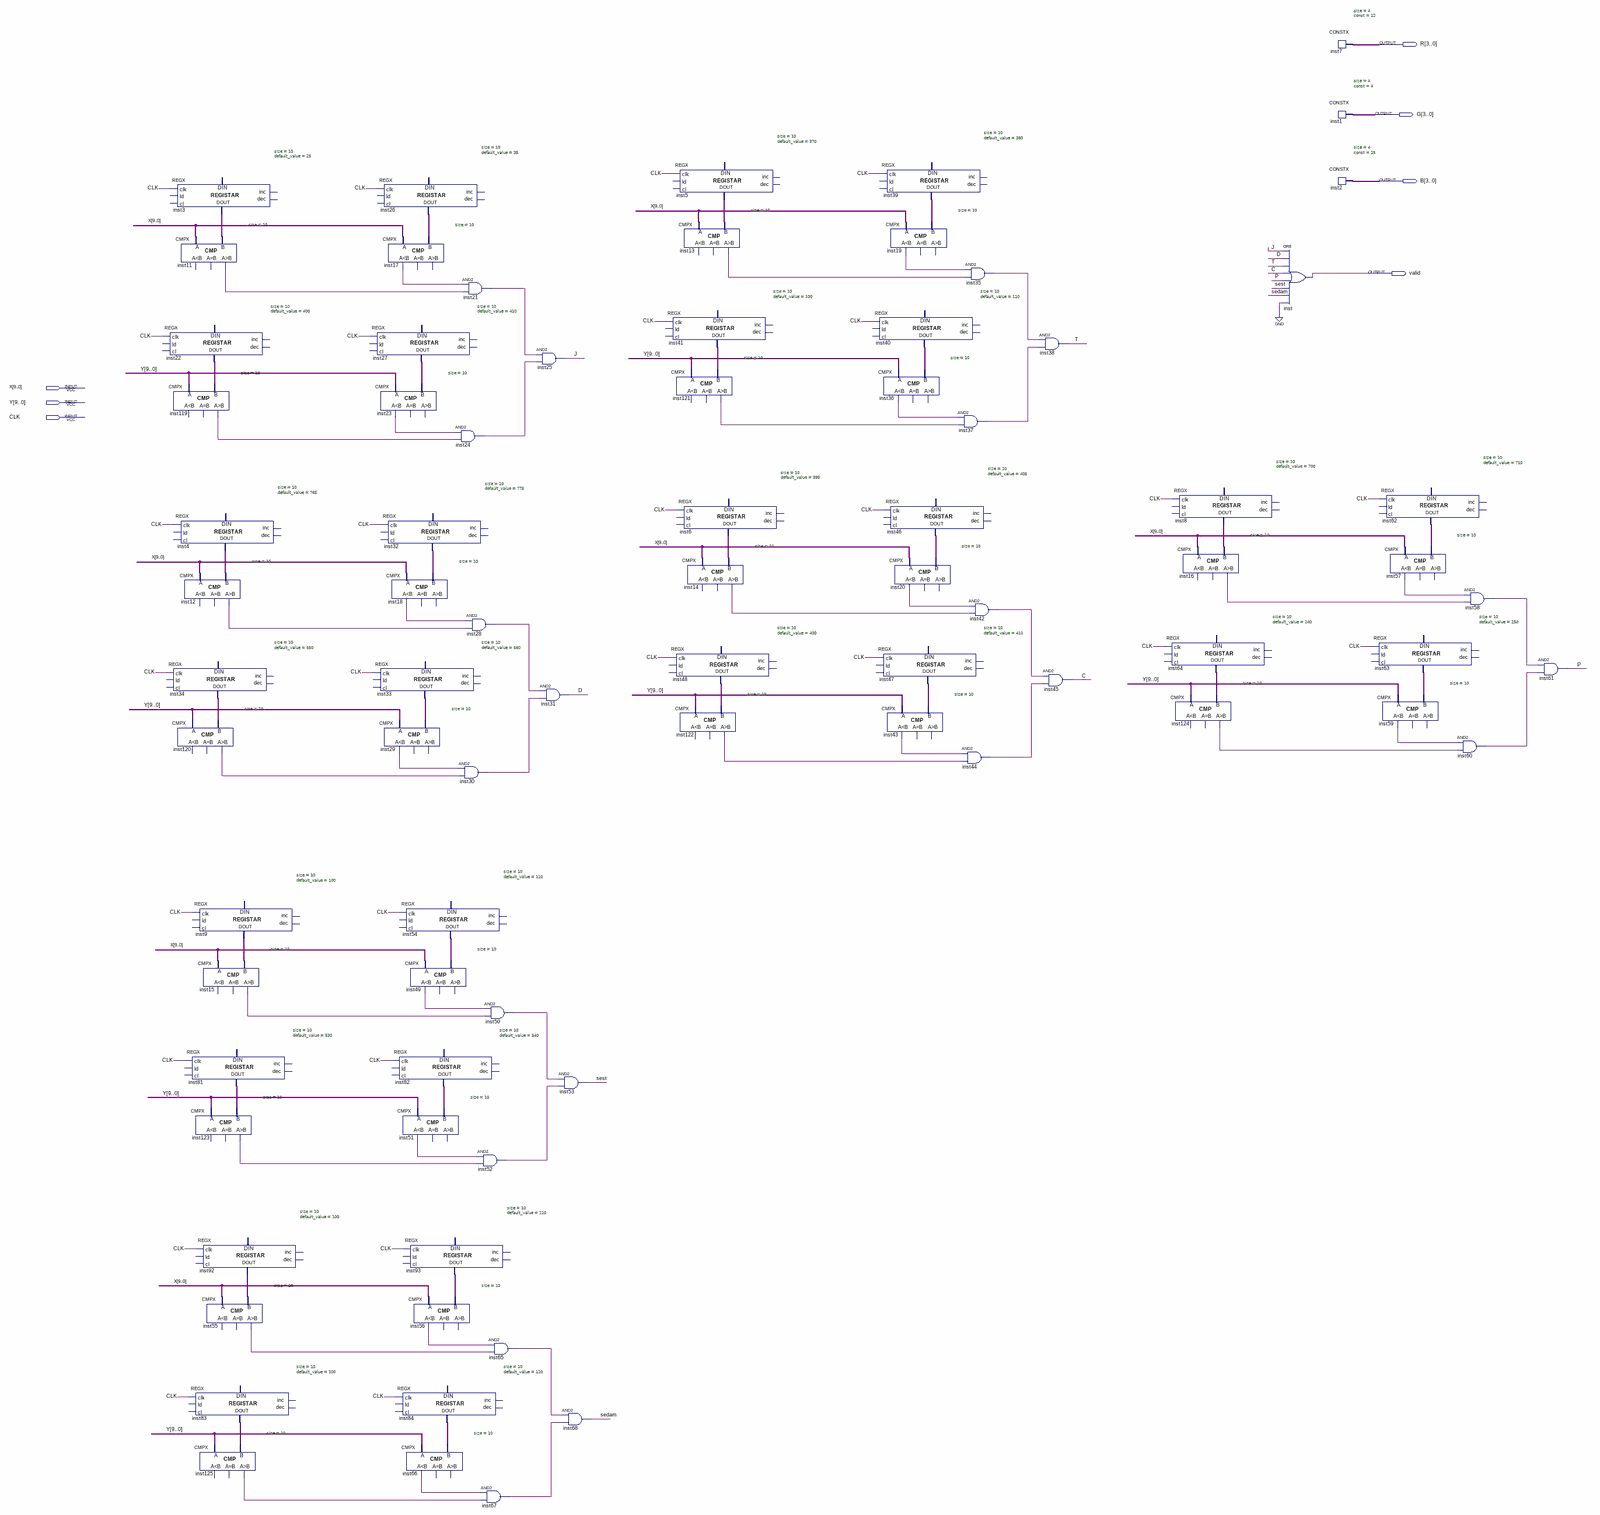
[diagram p0: schematic sheet, whole]
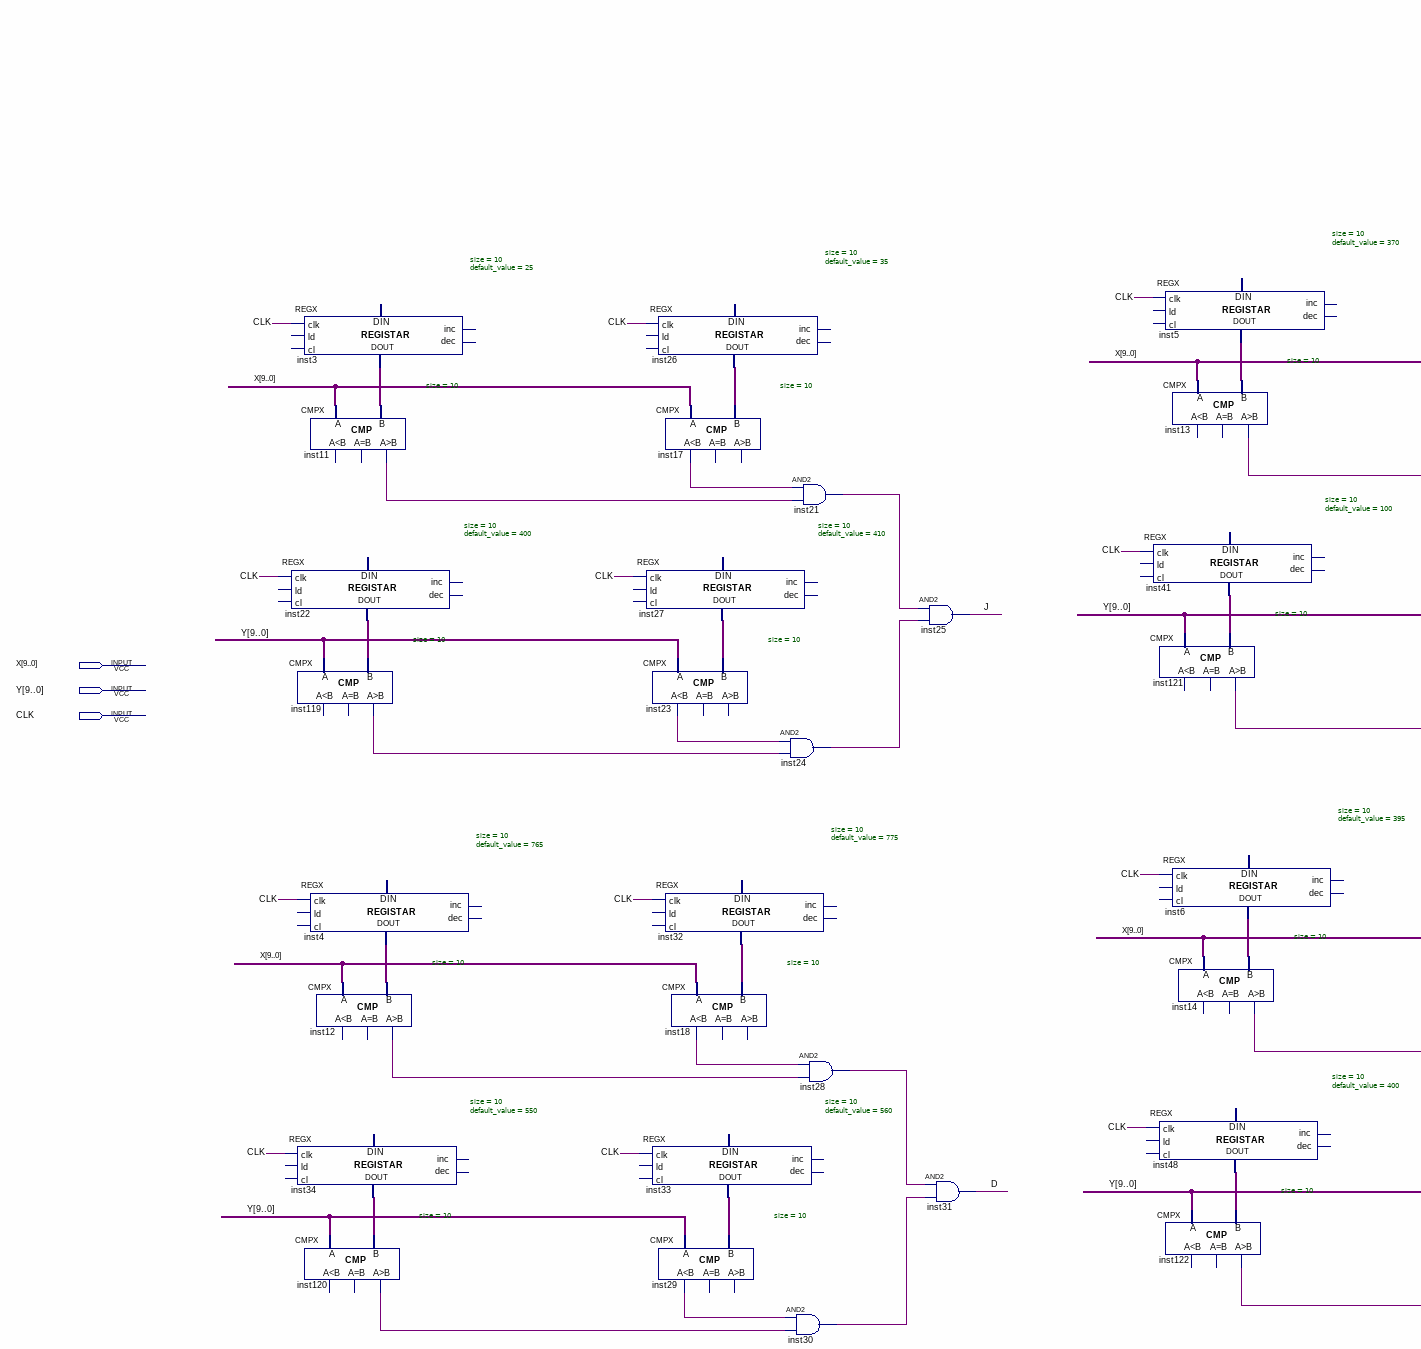
[diagram p1: schematic sheet, upper left part]
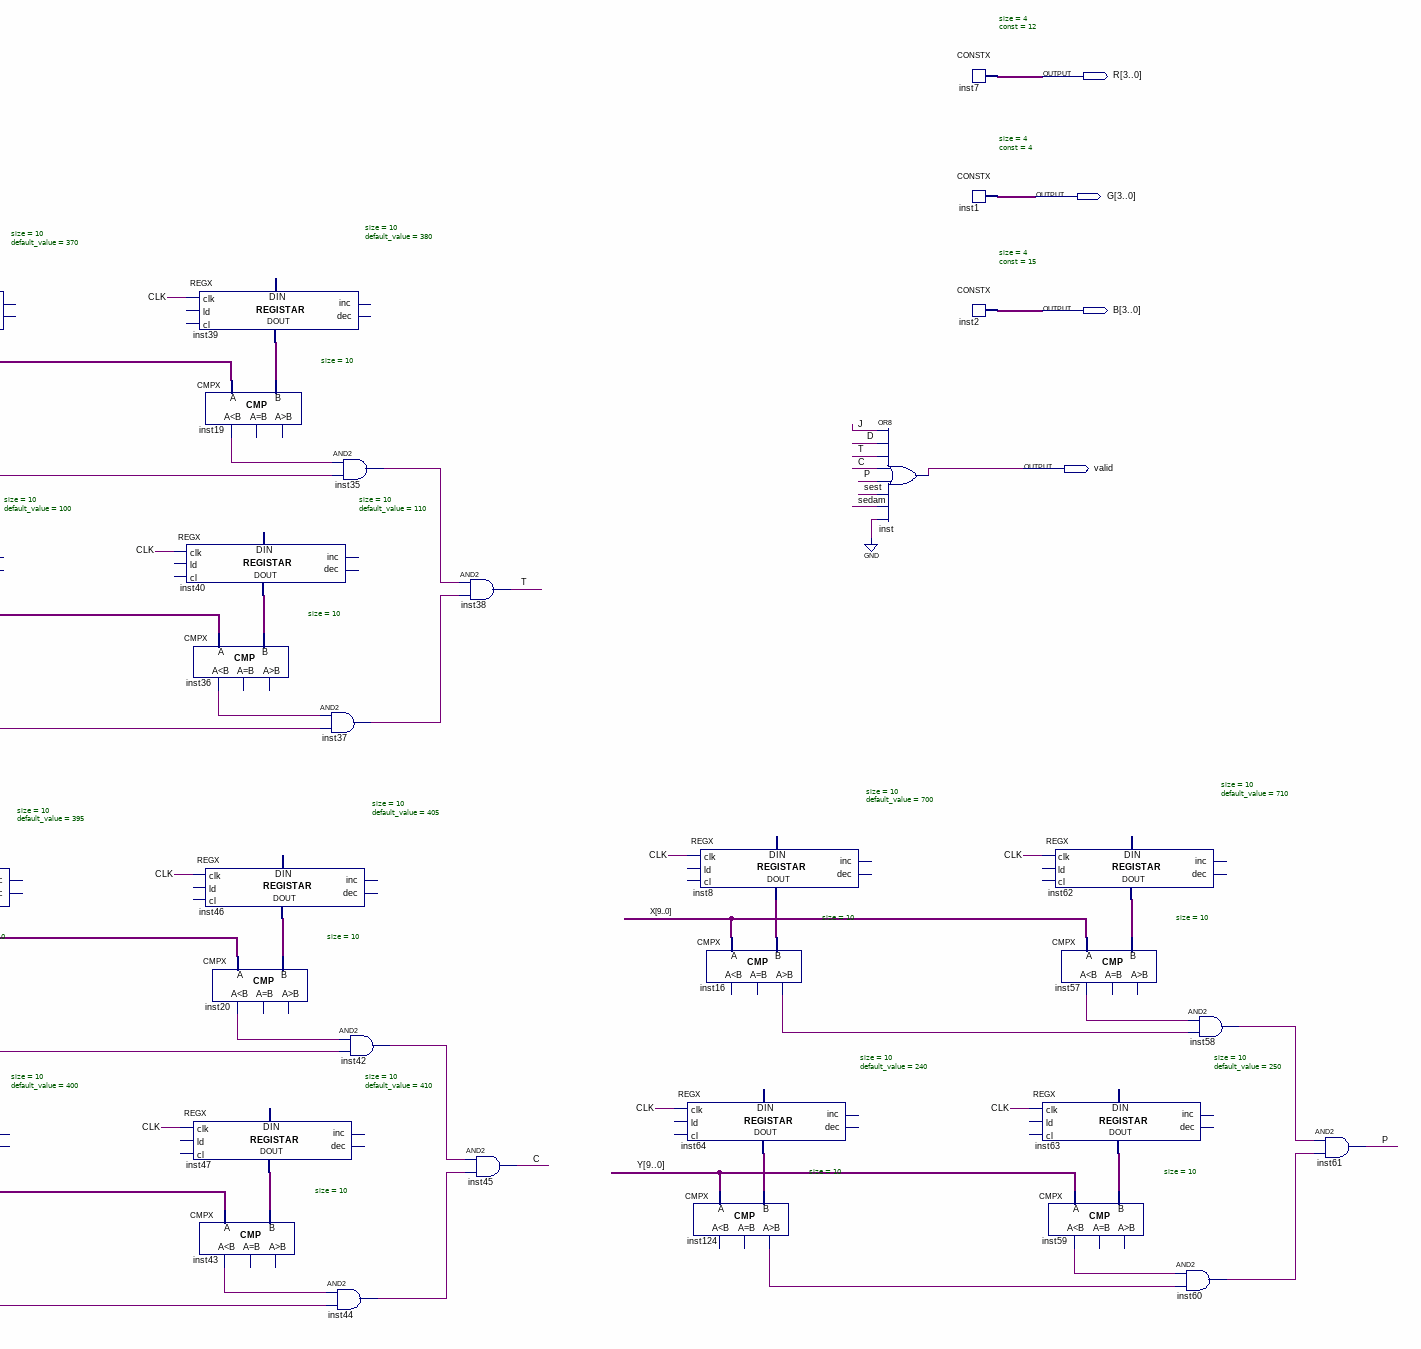
[diagram p2: schematic sheet, upper right part]
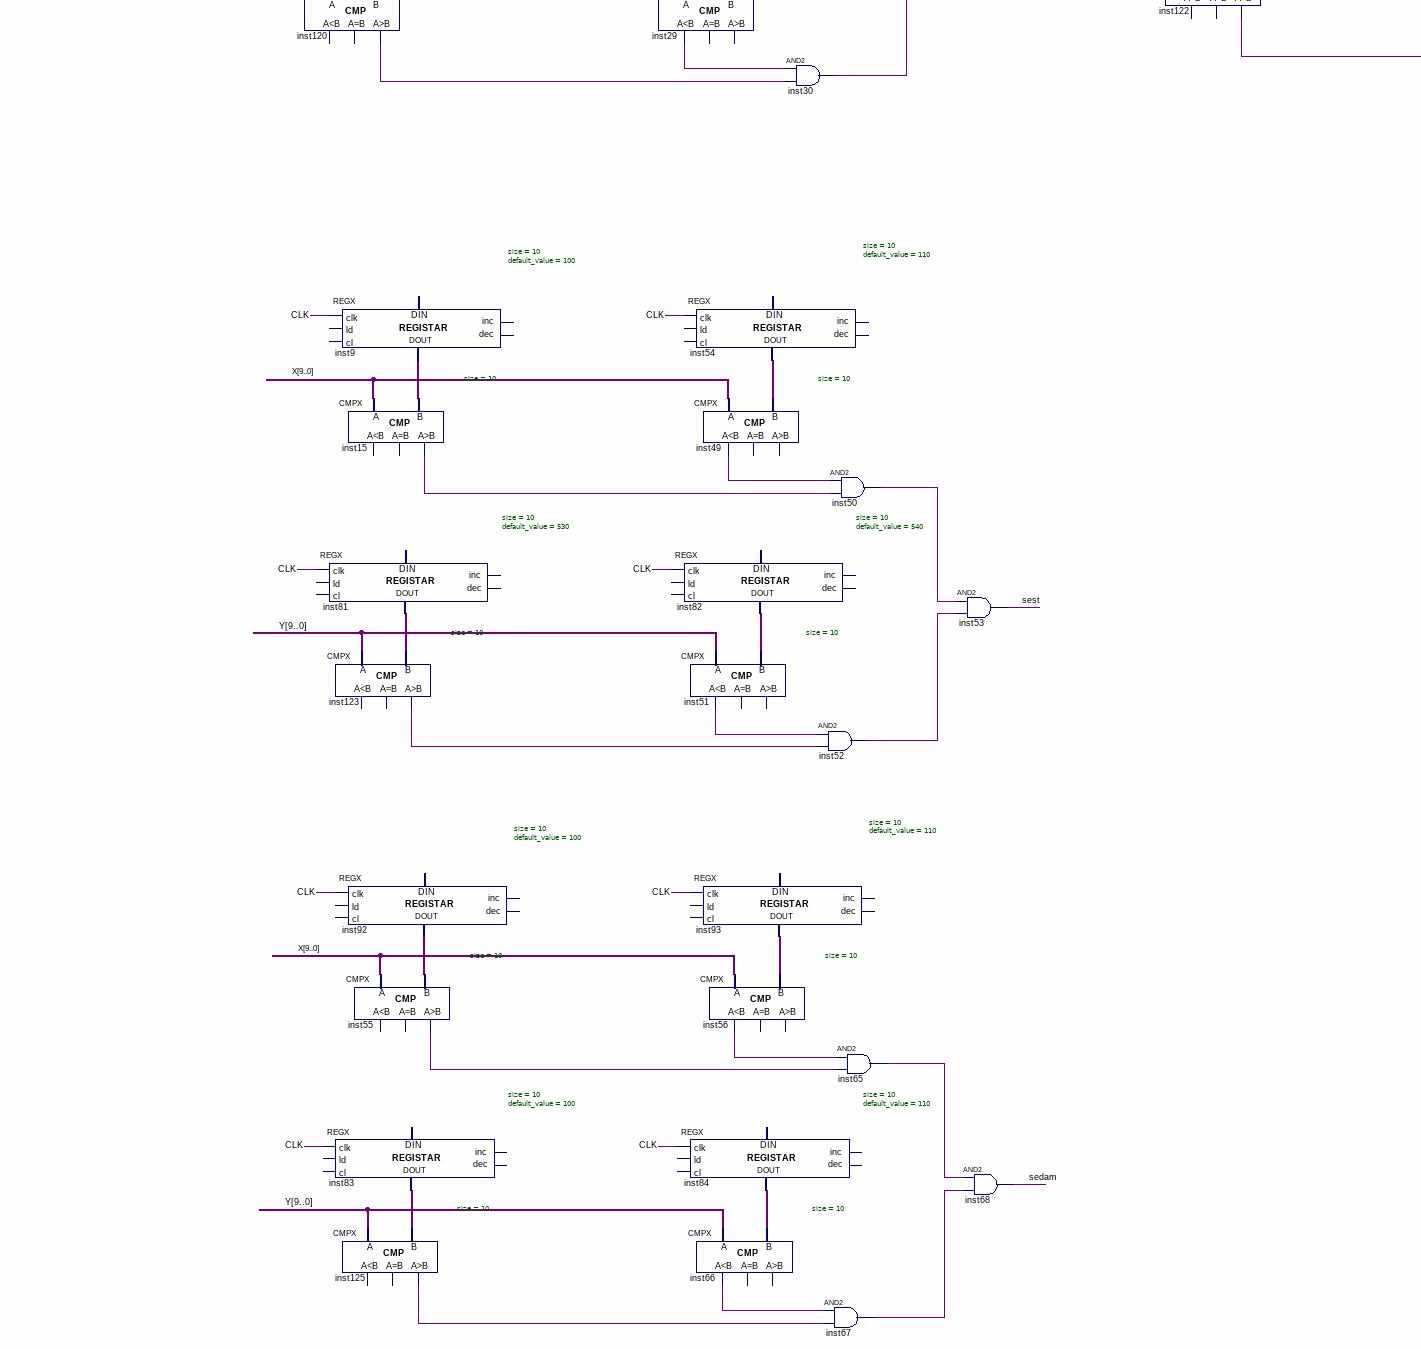
[diagram p3: schematic sheet, lower left part]
// Quartus schematic Ometaci.bdf as structural Verilog: 81 symbols, 7 pins
module Ometaci (
  input  [9:0] X,
  input  [9:0] Y,
  input  CLK,
  output [3:0] R,
  output [3:0] G,
  output [3:0] B,
  output valid
);

  wire C, D, inst11_gr, inst12_gr, inst13_gr, inst14_gr, inst15_gr, inst16_gr, inst17_ls, inst18_ls,
       inst19_ls, inst20_ls, inst21_out, inst23_ls, inst24_out, inst28_out, inst29_ls, inst30_out,
       inst35_out, inst36_ls, inst37_out, inst42_out, inst43_ls, inst44_out, inst49_ls, inst50_out,
       inst51_ls, inst52_out, inst55_gr, inst56_ls, inst57_ls, inst58_out, inst59_ls, inst60_out, inst65_out,
       inst66_ls, inst67_out, inst119_gr, inst120_gr, inst121_gr, inst122_gr, inst123_gr, inst124_gr,
       inst125_gr, J, P, sedam, sest, T;
  wire [9:0] inst3_data_out, inst4_data_out, inst5_data_out, inst6_data_out, inst8_data_out, inst9_data_out,
       inst22_data_out, inst26_data_out, inst27_data_out, inst32_data_out, inst33_data_out, inst34_data_out,
       inst39_data_out, inst40_data_out, inst41_data_out, inst46_data_out, inst47_data_out, inst48_data_out,
       inst54_data_out, inst62_data_out, inst63_data_out, inst64_data_out, inst81_data_out, inst82_data_out,
       inst83_data_out, inst84_data_out, inst92_data_out, inst93_data_out;

  REGX #(.size(10), .default_value(25)) inst3 (
    .clk(CLK), .data_out(inst3_data_out));  // open: ld, cl, inc, dec, data_in
  CMPX #(.size(10)) inst11 (.A(X), .B(inst3_data_out), .gr(inst11_gr));  // open: ls, eq
  REGX #(.size(10), .default_value(400)) inst22 (
    .clk(CLK), .data_out(inst22_data_out));  // open: ld, cl, inc, dec, data_in
  CMPX #(.size(10)) inst119 (.A(Y), .B(inst22_data_out), .gr(inst119_gr));  // open: ls, eq
  REGX #(.size(10), .default_value(765)) inst4 (
    .clk(CLK), .data_out(inst4_data_out));  // open: ld, cl, inc, dec, data_in
  CMPX #(.size(10)) inst12 (.A(X), .B(inst4_data_out), .gr(inst12_gr));  // open: ls, eq
  REGX #(.size(10), .default_value(550)) inst34 (
    .clk(CLK), .data_out(inst34_data_out));  // open: ld, cl, inc, dec, data_in
  CMPX #(.size(10)) inst120 (.A(Y), .B(inst34_data_out), .gr(inst120_gr));  // open: ls, eq
  REGX #(.size(10), .default_value(100)) inst9 (
    .clk(CLK), .data_out(inst9_data_out));  // open: ld, cl, inc, dec, data_in
  CMPX #(.size(10)) inst15 (.A(X), .B(inst9_data_out), .gr(inst15_gr));  // open: ls, eq
  REGX #(.size(10), .default_value(530)) inst81 (
    .clk(CLK), .data_out(inst81_data_out));  // open: ld, cl, inc, dec, data_in
  CMPX #(.size(10)) inst123 (.A(Y), .B(inst81_data_out), .gr(inst123_gr));  // open: ls, eq
  REGX #(.size(10), .default_value(100)) inst92 (
    .clk(CLK), .data_out(inst92_data_out));  // open: ld, cl, inc, dec, data_in
  CMPX #(.size(10)) inst55 (.A(X), .B(inst92_data_out), .gr(inst55_gr));  // open: ls, eq
  REGX #(.size(10), .default_value(100)) inst83 (
    .clk(CLK), .data_out(inst83_data_out));  // open: ld, cl, inc, dec, data_in
  CMPX #(.size(10)) inst125 (.A(Y), .B(inst83_data_out), .gr(inst125_gr));  // open: ls, eq
  REGX #(.size(10), .default_value(35)) inst26 (
    .clk(CLK), .data_out(inst26_data_out));  // open: ld, cl, inc, dec, data_in
  CMPX #(.size(10)) inst17 (.A(X), .B(inst26_data_out), .ls(inst17_ls));  // open: eq, gr
  REGX #(.size(10), .default_value(410)) inst27 (
    .clk(CLK), .data_out(inst27_data_out));  // open: ld, cl, inc, dec, data_in
  CMPX #(.size(10)) inst23 (.A(Y), .B(inst27_data_out), .ls(inst23_ls));  // open: eq, gr
  REGX #(.size(10), .default_value(775)) inst32 (
    .clk(CLK), .data_out(inst32_data_out));  // open: ld, cl, inc, dec, data_in
  CMPX #(.size(10)) inst18 (.A(X), .B(inst32_data_out), .ls(inst18_ls));  // open: eq, gr
  REGX #(.size(10), .default_value(560)) inst33 (
    .clk(CLK), .data_out(inst33_data_out));  // open: ld, cl, inc, dec, data_in
  CMPX #(.size(10)) inst29 (.A(Y), .B(inst33_data_out), .ls(inst29_ls));  // open: eq, gr
  REGX #(.size(10), .default_value(110)) inst54 (
    .clk(CLK), .data_out(inst54_data_out));  // open: ld, cl, inc, dec, data_in
  CMPX #(.size(10)) inst49 (.A(X), .B(inst54_data_out), .ls(inst49_ls));  // open: eq, gr
  REGX #(.size(10), .default_value(540)) inst82 (
    .clk(CLK), .data_out(inst82_data_out));  // open: ld, cl, inc, dec, data_in
  CMPX #(.size(10)) inst51 (.A(Y), .B(inst82_data_out), .ls(inst51_ls));  // open: eq, gr
  REGX #(.size(10), .default_value(110)) inst93 (
    .clk(CLK), .data_out(inst93_data_out));  // open: ld, cl, inc, dec, data_in
  CMPX #(.size(10)) inst56 (.A(X), .B(inst93_data_out), .ls(inst56_ls));  // open: eq, gr
  REGX #(.size(10), .default_value(110)) inst84 (
    .clk(CLK), .data_out(inst84_data_out));  // open: ld, cl, inc, dec, data_in
  CMPX #(.size(10)) inst66 (.A(Y), .B(inst84_data_out), .ls(inst66_ls));  // open: eq, gr
  and inst21 (inst21_out, inst17_ls, inst11_gr);
  and inst24 (inst24_out, inst23_ls, inst119_gr);
  and inst28 (inst28_out, inst18_ls, inst12_gr);
  and inst30 (inst30_out, inst29_ls, inst120_gr);
  and inst52 (inst52_out, inst51_ls, inst123_gr);
  and inst50 (inst50_out, inst49_ls, inst15_gr);
  and inst65 (inst65_out, inst56_ls, inst55_gr);
  and inst67 (inst67_out, inst66_ls, inst125_gr);
  and inst25 (J, inst21_out, inst24_out);
  and inst31 (D, inst28_out, inst30_out);
  and inst53 (sest, inst50_out, inst52_out);
  and inst68 (sedam, inst65_out, inst67_out);
  REGX #(.size(10), .default_value(370)) inst5 (
    .clk(CLK), .data_out(inst5_data_out));  // open: ld, cl, inc, dec, data_in
  CMPX #(.size(10)) inst13 (.A(X), .B(inst5_data_out), .gr(inst13_gr));  // open: ls, eq
  REGX #(.size(10), .default_value(100)) inst41 (
    .clk(CLK), .data_out(inst41_data_out));  // open: ld, cl, inc, dec, data_in
  CMPX #(.size(10)) inst121 (.A(Y), .B(inst41_data_out), .gr(inst121_gr));  // open: ls, eq
  REGX #(.size(10), .default_value(395)) inst6 (
    .clk(CLK), .data_out(inst6_data_out));  // open: ld, cl, inc, dec, data_in
  CMPX #(.size(10)) inst14 (.A(X), .B(inst6_data_out), .gr(inst14_gr));  // open: ls, eq
  REGX #(.size(10), .default_value(400)) inst48 (
    .clk(CLK), .data_out(inst48_data_out));  // open: ld, cl, inc, dec, data_in
  CMPX #(.size(10)) inst122 (.A(Y), .B(inst48_data_out), .gr(inst122_gr));  // open: ls, eq
  REGX #(.size(10), .default_value(380)) inst39 (
    .clk(CLK), .data_out(inst39_data_out));  // open: ld, cl, inc, dec, data_in
  CMPX #(.size(10)) inst19 (.A(X), .B(inst39_data_out), .ls(inst19_ls));  // open: eq, gr
  REGX #(.size(10), .default_value(110)) inst40 (
    .clk(CLK), .data_out(inst40_data_out));  // open: ld, cl, inc, dec, data_in
  CMPX #(.size(10)) inst36 (.A(Y), .B(inst40_data_out), .ls(inst36_ls));  // open: eq, gr
  REGX #(.size(10), .default_value(405)) inst46 (
    .clk(CLK), .data_out(inst46_data_out));  // open: ld, cl, inc, dec, data_in
  CMPX #(.size(10)) inst20 (.A(X), .B(inst46_data_out), .ls(inst20_ls));  // open: eq, gr
  REGX #(.size(10), .default_value(410)) inst47 (
    .clk(CLK), .data_out(inst47_data_out));  // open: ld, cl, inc, dec, data_in
  CMPX #(.size(10)) inst43 (.A(Y), .B(inst47_data_out), .ls(inst43_ls));  // open: eq, gr
  and inst35 (inst35_out, inst19_ls, inst13_gr);
  and inst37 (inst37_out, inst36_ls, inst121_gr);
  and inst42 (inst42_out, inst20_ls, inst14_gr);
  and inst44 (inst44_out, inst43_ls, inst122_gr);
  and inst38 (T, inst35_out, inst37_out);
  and inst45 (C, inst42_out, inst44_out);
  REGX #(.size(10), .default_value(700)) inst8 (
    .clk(CLK), .data_out(inst8_data_out));  // open: ld, cl, inc, dec, data_in
  CMPX #(.size(10)) inst16 (.A(X), .B(inst8_data_out), .gr(inst16_gr));  // open: ls, eq
  REGX #(.size(10), .default_value(240)) inst64 (
    .clk(CLK), .data_out(inst64_data_out));  // open: ld, cl, inc, dec, data_in
  CMPX #(.size(10)) inst124 (.A(Y), .B(inst64_data_out), .gr(inst124_gr));  // open: ls, eq
  or inst (valid, J, D, T, C, P, sest, sedam, 1'b0);
  CONSTX #(.size(4), .\const (12)) inst7 (.data(R));
  CONSTX #(.size(4), .\const (4)) inst1 (.data(G));
  CONSTX #(.size(4), .\const (15)) inst2 (.data(B));
  REGX #(.size(10), .default_value(710)) inst62 (
    .clk(CLK), .data_out(inst62_data_out));  // open: ld, cl, inc, dec, data_in
  CMPX #(.size(10)) inst57 (.A(X), .B(inst62_data_out), .ls(inst57_ls));  // open: eq, gr
  REGX #(.size(10), .default_value(250)) inst63 (
    .clk(CLK), .data_out(inst63_data_out));  // open: ld, cl, inc, dec, data_in
  CMPX #(.size(10)) inst59 (.A(Y), .B(inst63_data_out), .ls(inst59_ls));  // open: eq, gr
  and inst58 (inst58_out, inst57_ls, inst16_gr);
  and inst60 (inst60_out, inst59_ls, inst124_gr);
  and inst61 (P, inst58_out, inst60_out);
endmodule
